# EAGLE schematic gpio-board (EAGLE 9.6.2)

## Sheet 1 of 10
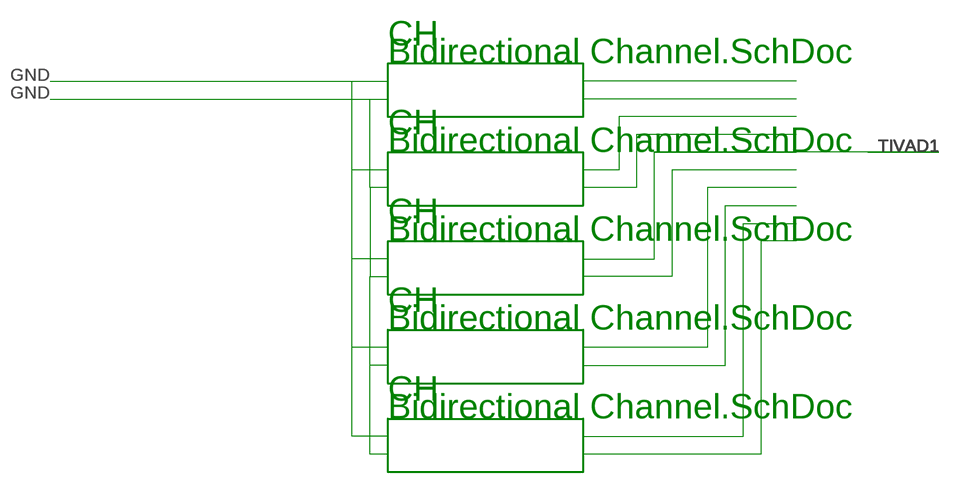
[diagram p0: schematic, sheet 1]

### Notes on the sheet
- CH
- Bidirectional Channel.SchDoc
- CH
- Bidirectional Channel.SchDoc
- CH
- Bidirectional Channel.SchDoc
- CH
- Bidirectional Channel.SchDoc
- CH
- Bidirectional Channel.SchDoc

## Sheet 2 of 10
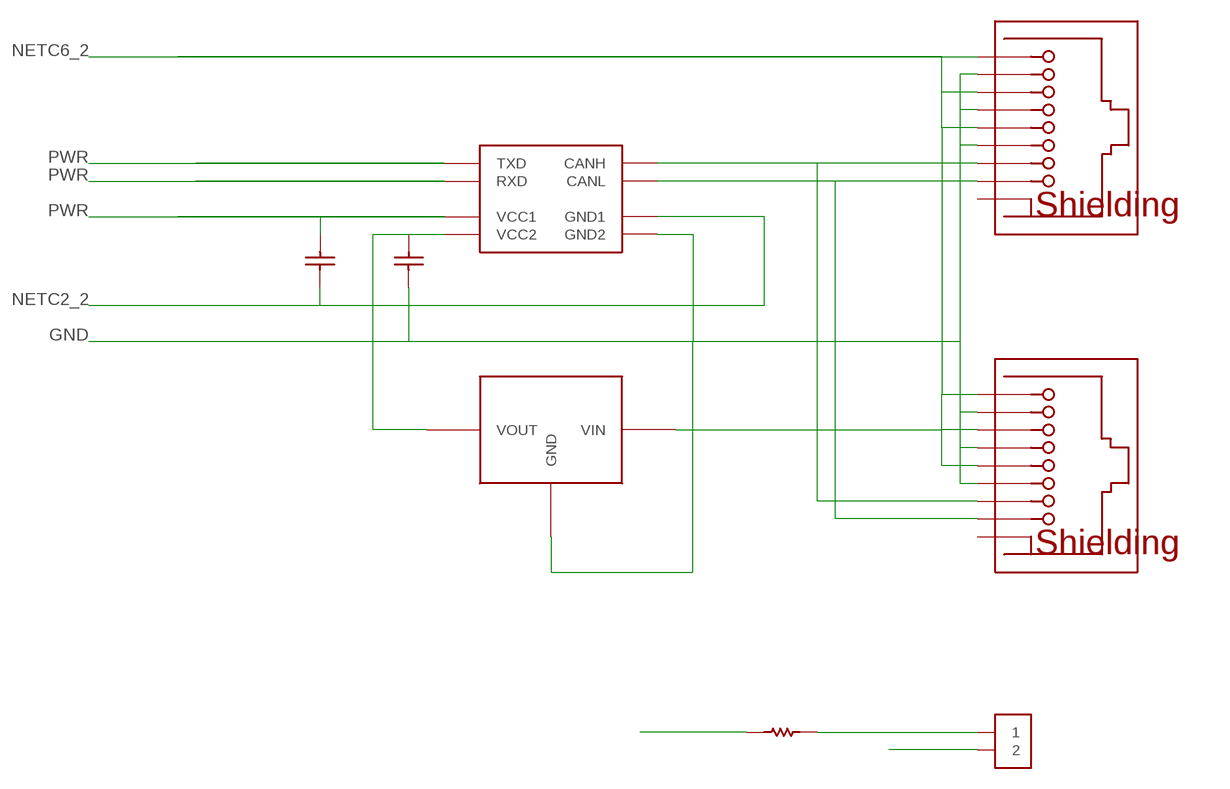
[diagram p1: schematic, sheet 2]

### Parts
C1  CMP-134292-3  (no package)
C2  CMP-134292-3  (no package)
CAN1  SYM-617644-1  (no package)
CAN2  SYM-617644-1  (no package)
R6  CMP-3663850-2  (no package)
TERM  SYM-31C1F8CF33E2EE06-1  (no package)
U1  TI-ISO1050-SOP_DUB-8  (no package)
U2  SYM-21FAE9BB1208FE3D-1  (no package)

### Nets
CANH: CAN1.7 CAN2.7 R6.1 U1.CANH
CANL: CAN1.8 CAN2.8 TERM.2 U1.CANL
GND: C1.2 U1.GND1 ; also sheet 1,3,4,5,6,7,8,9,10
NETC2_1: C2.1 U1.VCC2 U2.VOUT
NETC2_2: C2.2 CAN1.2 CAN1.4 CAN1.6 CAN2.2 CAN2.4 CAN2.6 U1.GND2 U2.GND ; also sheet 3,7
NETC6_2: CAN1.1 CAN1.3 CAN1.5 CAN2.1 CAN2.3 CAN2.5 U2.VIN ; also sheet 3,7
NETR6_2: R6.2 TERM.1
NETU1_2: U1.RXD ; also sheet 6,7
NETU1_3: U1.TXD ; also sheet 6,7
PWR: C1.1 U1.VCC1 ; also sheet 3,4,5,6,7,9,10
Unconnected: C1.1 C1.2 C2.1 C2.2 CAN1.SHIELDING CAN2.SHIELDING R6.1 R6.2

## Sheet 3 of 10
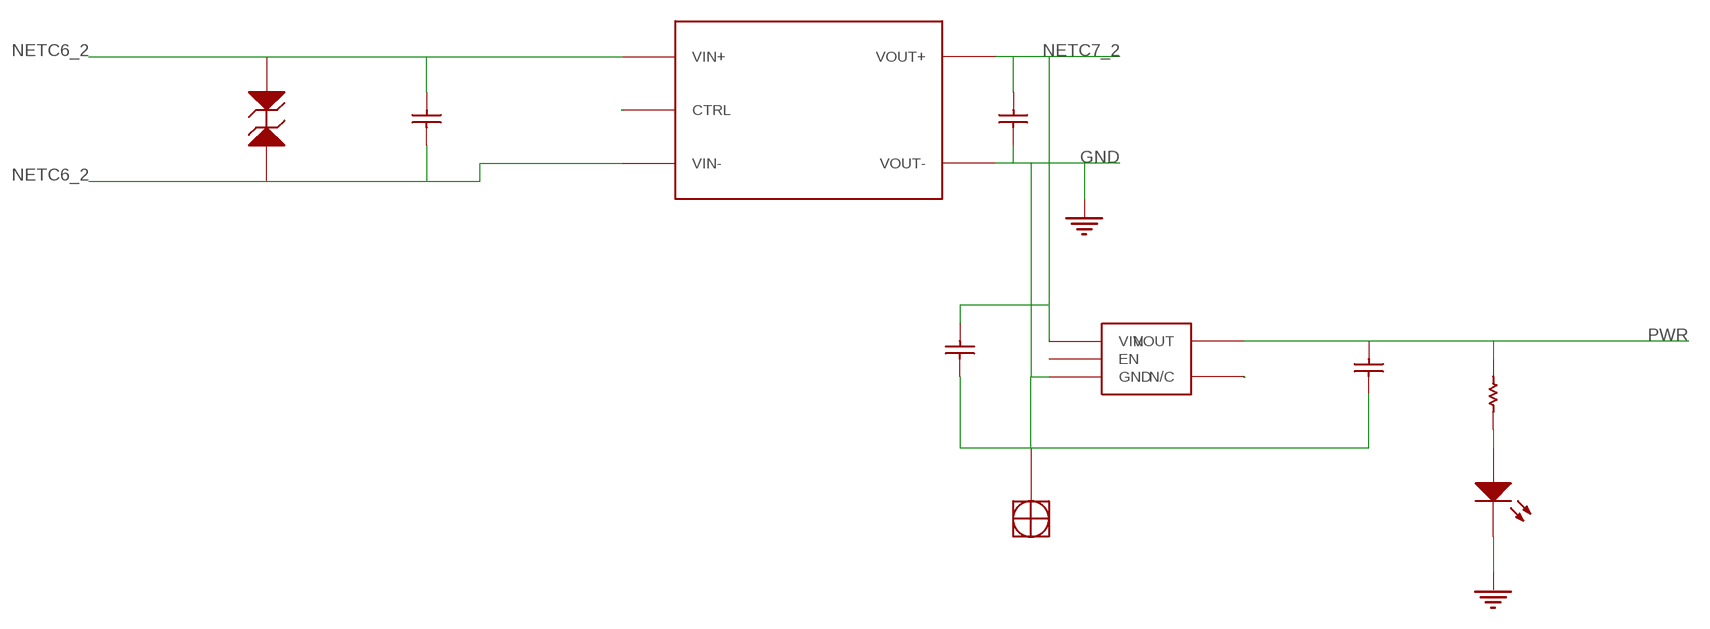
[diagram p2: schematic, sheet 3]

### Parts
C6  SYM-8A2242A3401455E5-1  (no package)
C7  SYM-8A2242A3401455E5-1  (no package)
C12  CMP-134292-3  (no package)
C16  CMP-E20E28C4DC043DC9-1  (no package)
D5  SYM-152EDD67E2CECAE9-1  (no package)
GND1  GND  (no package)
GND2  GND  (no package)
PWR  CMP-46948CFC171D9953-1  (no package)
R7  RES-2  (no package)
TP2  SYM-KVU467Q7N58Y0FITGGB9-1  (no package)
U5  SYM-6Q2ZFNS2C222HNUJAU44-1  (no package)
U6  SYM-7094B98C0241AF53-1  (no package)

### Nets
GND: C7.1 C12.2 C16.1 GND1.GND GND2.GND PWR.2 TP2.1 U5.VOUT- U6.GND ; also sheet 1,2,4,5,6,7,8,9,10
N$1: U5.CTRL
N$8: U6.N/C
NETC2_2: C6.1 D5.A U5.VIN- ; also sheet 2,7
NETC6_2: C6.2 D5.K U5.VIN+ ; also sheet 2,7
NETC7_2: C7.2 C12.1 U5.VOUT+ U6.EN U6.VIN ; also sheet 7,10
NETPWR_1: PWR.1 R7.1
PWR: C16.2 R7.2 U6.VOUT ; also sheet 2,4,5,6,7,9,10
Unconnected: C12.1 C12.2 R7.1 R7.2

## Sheet 4 of 10
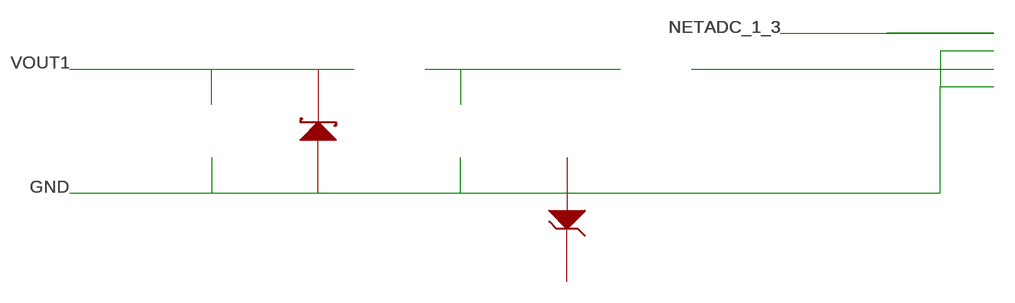
[diagram p3: schematic, sheet 4]

### Parts
D1  SYM-BLEVZ7ZR8NTS6PG0EPLK-1  (no package)
D2  SYM-J4BLMASUWRZVB9CLMQR4-1  (no package)

### Nets
GND: D2.2 ; also sheet 1,2,3,5,6,7,8,9,10
VOUT1: D2.1 ; also sheet 6,7,8
Unconnected: D1.1 D1.3 D1.A D1.K D2.A D2.K

## Sheet 5 of 10
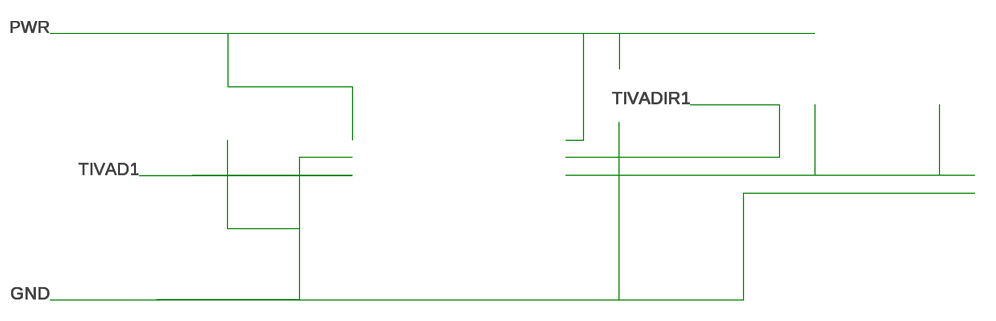
[diagram p4: schematic, sheet 5]

## Sheet 6 of 10
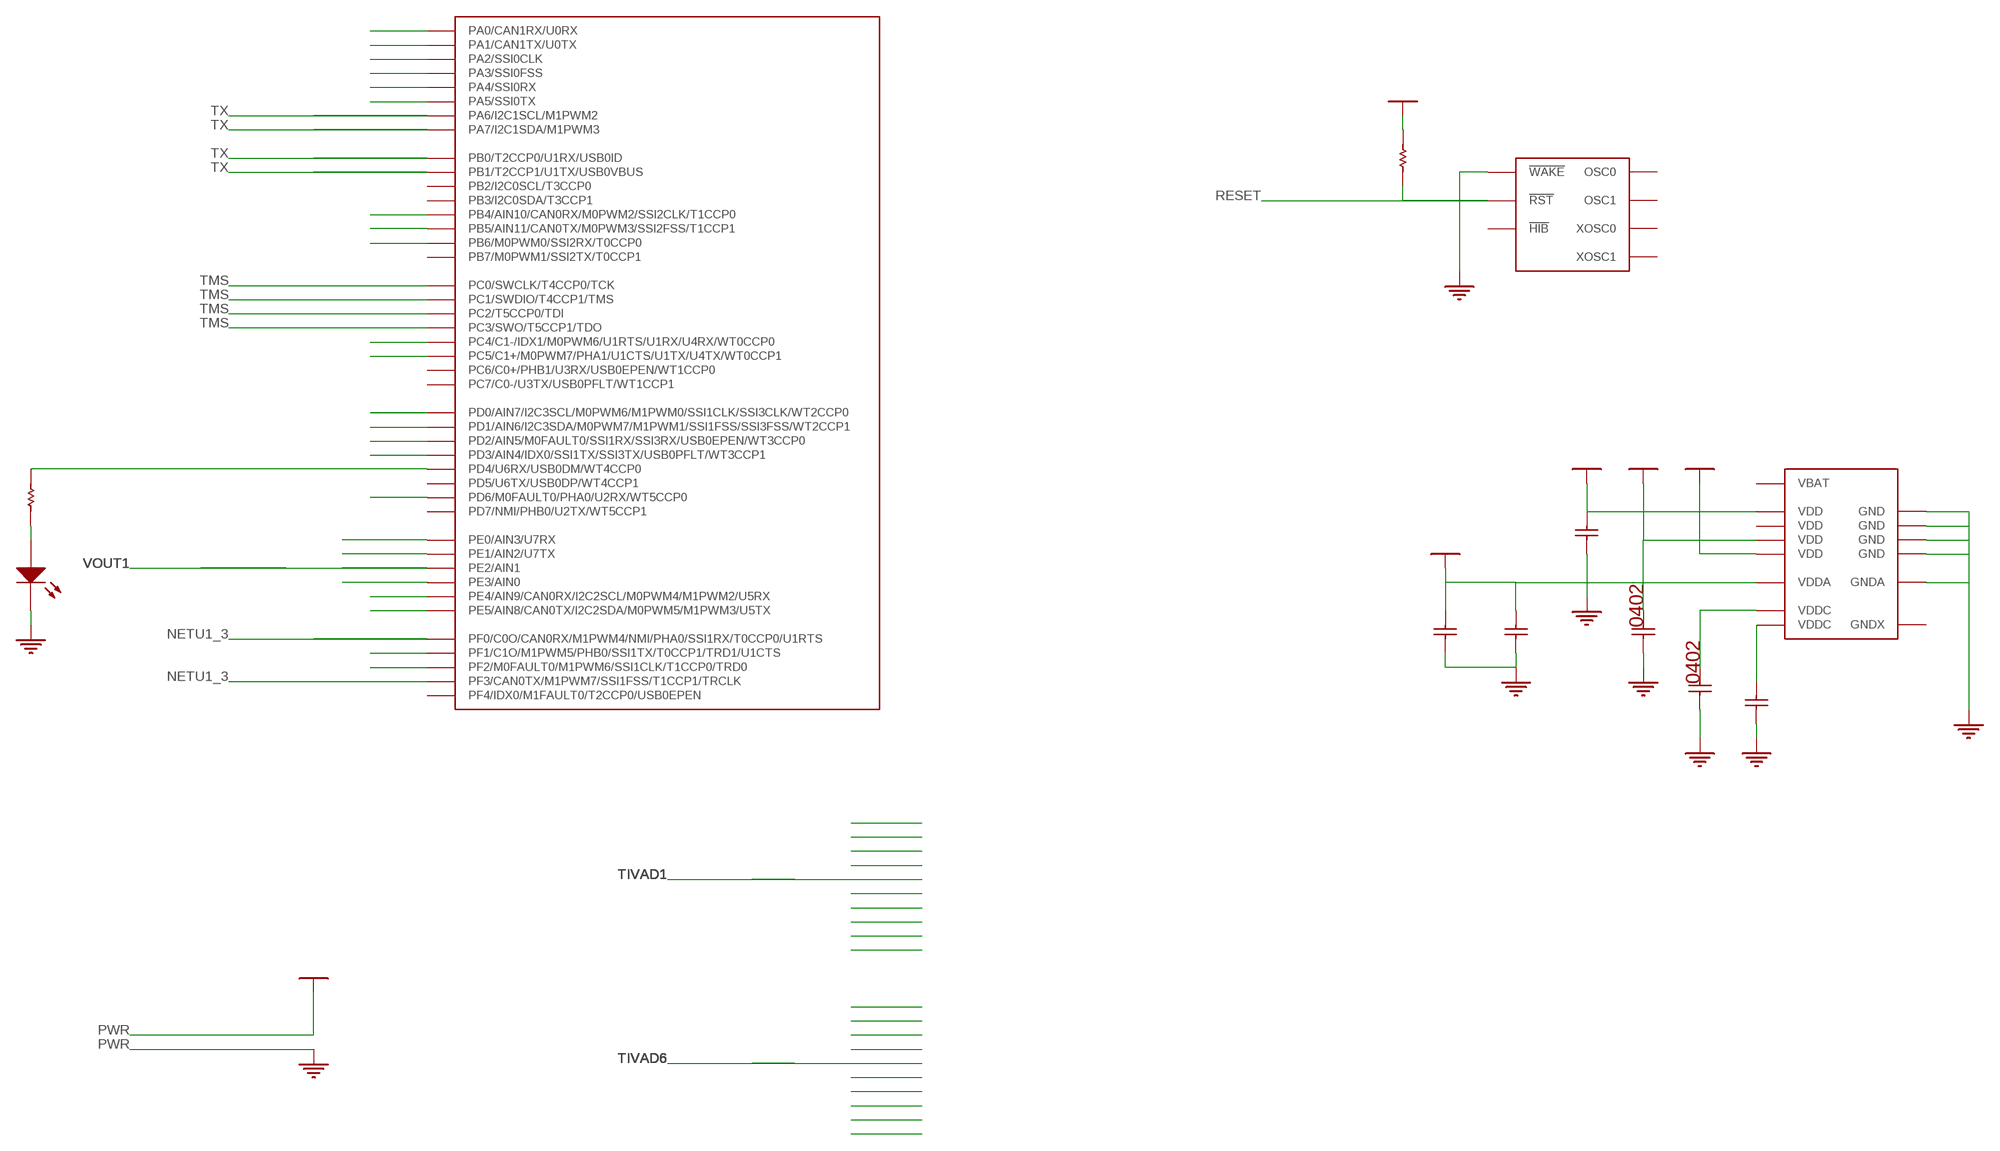
[diagram p5: schematic, sheet 6]

### Parts
C8  CMP-132626-3  (no package)
C9  CMP-119445-3  (no package)
C10  CMP-134292-3  (no package)
C11  CMP-132626-3  (no package)
C13  CMP-E20E28C4DC043DC9-1  (no package)
C15  CMP-3A10F0DA043EE5D7-2  (no package)
DEBUG  CMP-46948CFC171D9953-1  (no package)
GND3  GND  (no package)
GND4  GND  (no package)
GND5  GND  (no package)
GND6  GND  (no package)
GND7  GND  (no package)
GND8  GND  (no package)
GND9  GND  (no package)
GND10  GND  (no package)
GND11  GND  (no package)
PVCC1  VCC  (no package)
PVCC2  VCC  (no package)
PVCC3  VCC  (no package)
PVCC4  VCC  (no package)
PVCC5  VCC  (no package)
PVCC6  VCC  (no package)
R9  CMP-1845928-9  (no package)
R10  RES-2  (no package)
U4  TI-TM4C123GH6PM-LQFP-64  (no package)
U4G2  TI-TM4C123GH6PM-LQFP-64  (no package)
U4G3  TI-TM4C123GH6PM-LQFP-64  (no package)

### Nets
GND: C8.1 C9.1 C10.2 C11.1 C13.1 C15.1 DEBUG.2 GND3.GND GND4.GND GND5.GND GND6.GND GND7.GND GND8.GND GND9.GND GND10.GND GND11.GND U4G2.!WAKE U4G3.GND U4G3.GNDA ; also sheet 1,2,3,4,5,7,8,9,10
NETC11_2: C11.2 U4G3.VDDC
NETC15_2: C15.2 U4G3.VDDC
NETD1_3: U4.PA7/I2C1SDA/M1PWM3 ; also sheet 7,10
NETD3_3: U4.PA6/I2C1SCL/M1PWM2 ; also sheet 7,10
NETDEBUG_1: DEBUG.1 R10.1
NETR10_2: R10.2 U4.PD4/U6RX/USB0DM/WT4CCP0
NETU1_2: U4.PF0/C0O/CAN0RX/M1PWM4/NMI/PHA0/SSI1RX/T0CCP0/U1RTS ; also sheet 2,7
NETU1_3: U4.PF3/CAN0TX/M1PWM7/SSI1FSS/T1CCP1/TRCLK ; also sheet 2,7
PWR: C8.2 C9.2 C10.1 C13.2 PVCC1.PWR PVCC2.PWR PVCC3.PWR PVCC4.PWR PVCC5.PWR PVCC6.PWR R9.2 U4G3.VDD U4G3.VDDA ; also sheet 2,3,4,5,7,9,10
RESET: R9.1 U4G2.!RST ; also sheet 7,9
RX: U4.PB0/T2CCP0/U1RX/USB0ID ; also sheet 7,9
TCK: U4.PC0/SWCLK/T4CCP0/TCK ; also sheet 7,9
TDI: U4.PC2/T5CCP0/TDI ; also sheet 7,9
TDO: U4.PC3/SWO/T5CCP1/TDO ; also sheet 7,9
TIVAD1: U4.PB5/AIN11/CAN0TX/M0PWM3/SSI2FSS/T1CCP1 ; also sheet 1,5,7
TIVAD2: U4.PE4/AIN9/CAN0RX/I2C2SCL/M0PWM4/M1PWM2/U5RX ; also sheet 1
TIVAD3: U4.PD0/AIN7/I2C3SCL/M0PWM6/M1PWM0/SSI1CLK/SSI3CLK/WT2CCP0
TIVAD4: U4.PD2/AIN5/M0FAULT0/SSI1RX/SSI3RX/USB0EPEN/WT3CCP0 ; also sheet 1
TIVAD5: U4.PB6/M0PWM0/SSI2RX/T0CCP0 ; also sheet 1
TIVAD6: U4.PC4/C1-/IDX1/M0PWM6/U1RTS/U1RX/U4RX/WT0CCP0 ; also sheet 7
TIVAD7: U4.PA1/CAN1TX/U0TX
TIVAD8: U4.PA3/SSI0FSS
TIVAD9: U4.PA5/SSI0TX
TIVAD10: U4.PF2/M0FAULT0/M1PWM6/SSI1CLK/T1CCP0/TRD0
TIVADIR1: U4.PD6/M0FAULT0/PHA0/U2RX/WT5CCP0 ; also sheet 1,5
TIVADIR2: U4.PB4/AIN10/CAN0RX/M0PWM2/SSI2CLK/T1CCP0 ; also sheet 1
TIVADIR3: U4.PE5/AIN8/CAN0TX/I2C2SDA/M0PWM5/M1PWM3/U5TX ; also sheet 1
TIVADIR4: U4.PD1/AIN6/I2C3SDA/M0PWM7/M1PWM1/SSI1FSS/SSI3FSS/WT2CCP1 ; also sheet 1
TIVADIR5: U4.PD3/AIN4/IDX0/SSI1TX/SSI3TX/USB0PFLT/WT3CCP1 ; also sheet 1
TIVADIR6: U4.PC5/C1+/M0PWM7/PHA1/U1CTS/U1TX/U4TX/WT0CCP1
TIVADIR7: U4.PA0/CAN1RX/U0RX
TIVADIR8: U4.PA2/SSI0CLK
TIVADIR9: U4.PA4/SSI0RX
TIVADIR10: U4.PF1/C1O/M1PWM5/PHB0/SSI1TX/T0CCP1/TRD1/U1CTS
TMS: U4.PC1/SWDIO/T4CCP1/TMS ; also sheet 7,9
TX: U4.PB1/T2CCP1/U1TX/USB0VBUS ; also sheet 7,9
VOUT1: U4.PE2/AIN1 U4.PE3/AIN0 ; also sheet 4,7,8
VOUT3: U4.PE1/AIN2/U7TX
VOUT4: U4.PE0/AIN3/U7RX ; also sheet 8
Unconnected: C9.1 C9.2 C10.1 C10.2 R10.1 R10.2 U4.!HIB U4.!RST U4.!WAKE U4.GND U4.GNDA U4.GNDX U4.OSC0 U4.OSC1 U4.PB2/I2C0SCL/T3CCP0 U4.PB3/I2C0SDA/T3CCP1 U4.PB7/M0PWM1/SSI2TX/T0CCP1 U4.PC6/C0+/PHB1/U3RX/USB0EPEN/WT1CCP0 U4.PC7/C0-/U3TX/USB0PFLT/WT1CCP1 U4.PD5/U6TX/USB0DP/WT4CCP1 U4.PD7/NMI/PHB0/U2TX/WT5CCP1 U4.PF4/IDX0/M1FAULT0/T2CCP0/USB0EPEN U4.VBAT U4.VDD U4.VDDA U4.VDDC U4.XOSC0 U4.XOSC1 U4G2.!HIB U4G2.GND U4G2.GNDA U4G2.GNDX U4G2.OSC0 U4G2.OSC1 U4G2.PA0/CAN1RX/U0RX U4G2.PA1/CAN1TX/U0TX U4G2.PA2/SSI0CLK U4G2.PA3/SSI0FSS U4G2.PA4/SSI0RX U4G2.PA5/SSI0TX U4G2.PA6/I2C1SCL/M1PWM2 U4G2.PA7/I2C1SDA/M1PWM3 U4G2.PB0/T2CCP0/U1RX/USB0ID U4G2.PB1/T2CCP1/U1TX/USB0VBUS U4G2.PB2/I2C0SCL/T3CCP0 U4G2.PB3/I2C0SDA/T3CCP1 U4G2.PB4/AIN10/CAN0RX/M0PWM2/SSI2CLK/T1CCP0 U4G2.PB5/AIN11/CAN0TX/M0PWM3/SSI2FSS/T1CCP1 U4G2.PB6/M0PWM0/SSI2RX/T0CCP0 U4G2.PB7/M0PWM1/SSI2TX/T0CCP1 U4G2.PC0/SWCLK/T4CCP0/TCK U4G2.PC1/SWDIO/T4CCP1/TMS U4G2.PC2/T5CCP0/TDI U4G2.PC3/SWO/T5CCP1/TDO U4G2.PC4/C1-/IDX1/M0PWM6/U1RTS/U1RX/U4RX/WT0CCP0 U4G2.PC5/C1+/M0PWM7/PHA1/U1CTS/U1TX/U4TX/WT0CCP1 U4G2.PC6/C0+/PHB1/U3RX/USB0EPEN/WT1CCP0 U4G2.PC7/C0-/U3TX/USB0PFLT/WT1CCP1 U4G2.PD0/AIN7/I2C3SCL/M0PWM6/M1PWM0/SSI1CLK/SSI3CLK/WT2CCP0 U4G2.PD1/AIN6/I2C3SDA/M0PWM7/M1PWM1/SSI1FSS/SSI3FSS/WT2CCP1 U4G2.PD2/AIN5/M0FAULT0/SSI1RX/SSI3RX/USB0EPEN/WT3CCP0 U4G2.PD3/AIN4/IDX0/SSI1TX/SSI3TX/USB0PFLT/WT3CCP1 U4G2.PD4/U6RX/USB0DM/WT4CCP0 U4G2.PD5/U6TX/USB0DP/WT4CCP1 U4G2.PD6/M0FAULT0/PHA0/U2RX/WT5CCP0 U4G2.PD7/NMI/PHB0/U2TX/WT5CCP1 U4G2.PE0/AIN3/U7RX U4G2.PE1/AIN2/U7TX U4G2.PE2/AIN1 U4G2.PE3/AIN0 U4G2.PE4/AIN9/CAN0RX/I2C2SCL/M0PWM4/M1PWM2/U5RX U4G2.PE5/AIN8/CAN0TX/I2C2SDA/M0PWM5/M1PWM3/U5TX U4G2.PF0/C0O/CAN0RX/M1PWM4/NMI/PHA0/SSI1RX/T0CCP0/U1RTS U4G2.PF1/C1O/M1PWM5/PHB0/SSI1TX/T0CCP1/TRD1/U1CTS U4G2.PF2/M0FAULT0/M1PWM6/SSI1CLK/T1CCP0/TRD0 U4G2.PF3/CAN0TX/M1PWM7/SSI1FSS/T1CCP1/TRCLK U4G2.PF4/IDX0/M1FAULT0/T2CCP0/USB0EPEN U4G2.VBAT U4G2.VDD U4G2.VDDA U4G2.VDDC U4G2.XOSC0 U4G2.XOSC1 U4G3.!HIB U4G3.!RST U4G3.!WAKE U4G3.GNDX U4G3.OSC0 U4G3.OSC1 U4G3.PA0/CAN1RX/U0RX U4G3.PA1/CAN1TX/U0TX U4G3.PA2/SSI0CLK U4G3.PA3/SSI0FSS U4G3.PA4/SSI0RX U4G3.PA5/SSI0TX U4G3.PA6/I2C1SCL/M1PWM2 U4G3.PA7/I2C1SDA/M1PWM3 U4G3.PB0/T2CCP0/U1RX/USB0ID U4G3.PB1/T2CCP1/U1TX/USB0VBUS U4G3.PB2/I2C0SCL/T3CCP0 U4G3.PB3/I2C0SDA/T3CCP1 U4G3.PB4/AIN10/CAN0RX/M0PWM2/SSI2CLK/T1CCP0 U4G3.PB5/AIN11/CAN0TX/M0PWM3/SSI2FSS/T1CCP1 U4G3.PB6/M0PWM0/SSI2RX/T0CCP0 U4G3.PB7/M0PWM1/SSI2TX/T0CCP1 U4G3.PC0/SWCLK/T4CCP0/TCK U4G3.PC1/SWDIO/T4CCP1/TMS U4G3.PC2/T5CCP0/TDI U4G3.PC3/SWO/T5CCP1/TDO U4G3.PC4/C1-/IDX1/M0PWM6/U1RTS/U1RX/U4RX/WT0CCP0 U4G3.PC5/C1+/M0PWM7/PHA1/U1CTS/U1TX/U4TX/WT0CCP1 U4G3.PC6/C0+/PHB1/U3RX/USB0EPEN/WT1CCP0 U4G3.PC7/C0-/U3TX/USB0PFLT/WT1CCP1 U4G3.PD0/AIN7/I2C3SCL/M0PWM6/M1PWM0/SSI1CLK/SSI3CLK/WT2CCP0 U4G3.PD1/AIN6/I2C3SDA/M0PWM7/M1PWM1/SSI1FSS/SSI3FSS/WT2CCP1 U4G3.PD2/AIN5/M0FAULT0/SSI1RX/SSI3RX/USB0EPEN/WT3CCP0 U4G3.PD3/AIN4/IDX0/SSI1TX/SSI3TX/USB0PFLT/WT3CCP1 U4G3.PD4/U6RX/USB0DM/WT4CCP0 U4G3.PD5/U6TX/USB0DP/WT4CCP1 U4G3.PD6/M0FAULT0/PHA0/U2RX/WT5CCP0 U4G3.PD7/NMI/PHB0/U2TX/WT5CCP1 U4G3.PE0/AIN3/U7RX U4G3.PE1/AIN2/U7TX U4G3.PE2/AIN1 U4G3.PE3/AIN0 U4G3.PE4/AIN9/CAN0RX/I2C2SCL/M0PWM4/M1PWM2/U5RX U4G3.PE5/AIN8/CAN0TX/I2C2SDA/M0PWM5/M1PWM3/U5TX U4G3.PF0/C0O/CAN0RX/M1PWM4/NMI/PHA0/SSI1RX/T0CCP0/U1RTS U4G3.PF1/C1O/M1PWM5/PHB0/SSI1TX/T0CCP1/TRD1/U1CTS U4G3.PF2/M0FAULT0/M1PWM6/SSI1CLK/T1CCP0/TRD0 U4G3.PF3/CAN0TX/M1PWM7/SSI1FSS/T1CCP1/TRCLK U4G3.PF4/IDX0/M1FAULT0/T2CCP0/USB0EPEN U4G3.VBAT U4G3.VDD U4G3.XOSC0 U4G3.XOSC1

## Sheet 7 of 10
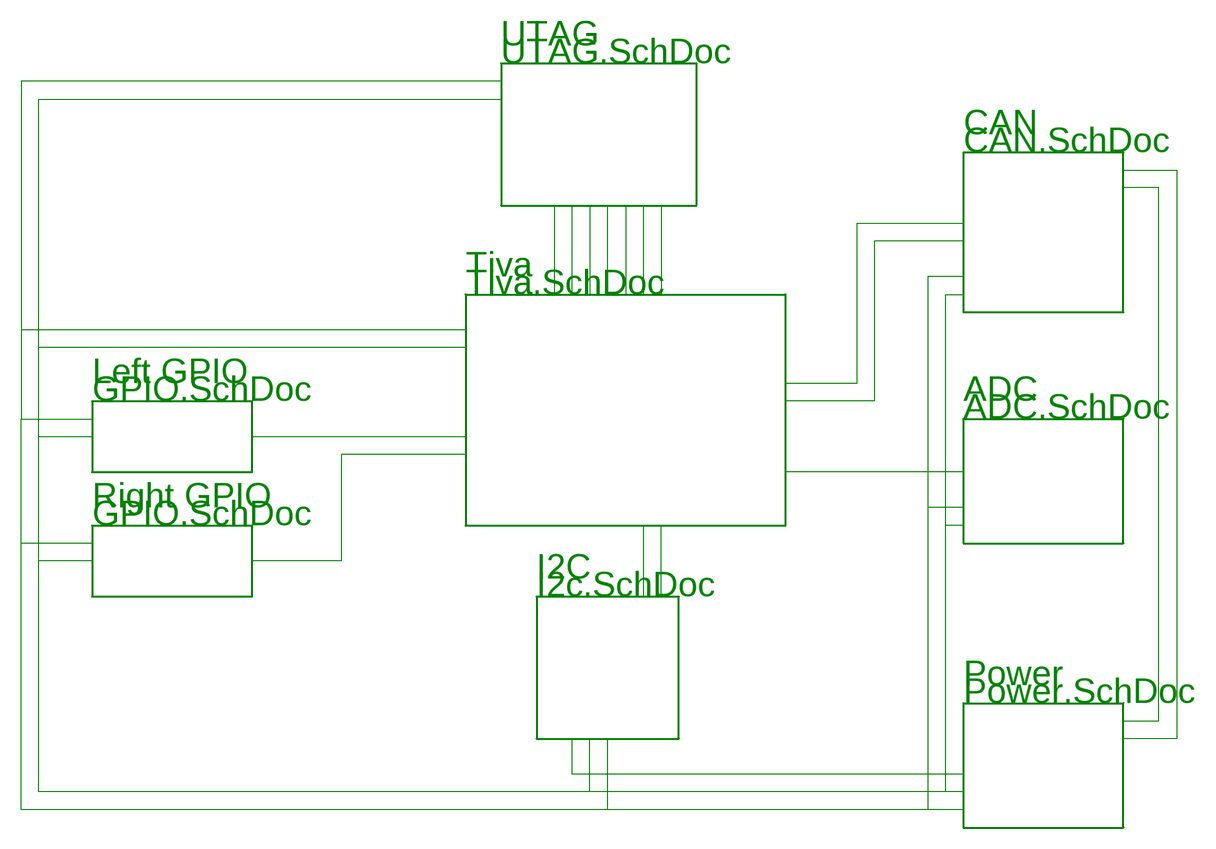
[diagram p6: schematic, sheet 7]

### Notes on the sheet
- UTAG
- UTAG.SchDoc
- CAN
- CAN.SchDoc
- Tiva
- Tiva.SchDoc
- Left GPIO
- GPIO.SchDoc | ADC
- ADC.SchDoc
- Right GPIO
- GPIO.SchDoc
- I2C
- I2c.SchDoc
- Power
- Power.SchDoc

## Sheet 8 of 10
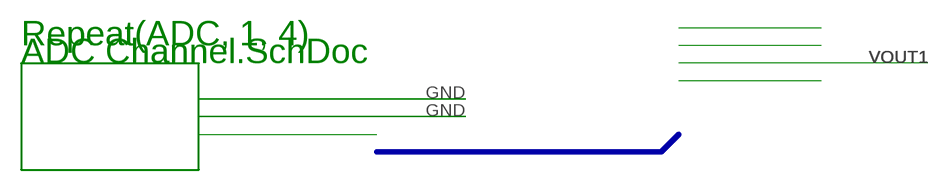
[diagram p7: schematic, sheet 8]

### Buses
BUS0000

### Notes on the sheet
- Repeat(ADC, 1, 4)
- ADC Channel.SchDoc

## Sheet 9 of 10
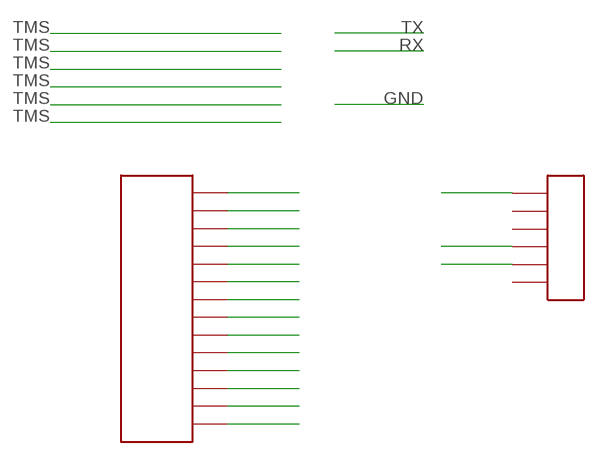
[diagram p8: schematic, sheet 9]

### Parts
PROG  CMP-94475D216EAA4B80-7  (no package)
UART  CMP-3923147-6  (no package)

### Nets
GND: PROG.4 PROG.6 PROG.8 PROG.10 PROG.12 UART.1 ; also sheet 1,2,3,4,5,6,7,8,10
N$17: PROG.9
NETPROG_13: PROG.13
NETPROG_14: PROG.14
PWR: PROG.5 ; also sheet 2,3,4,5,6,7,10
RESET: PROG.2 ; also sheet 6,7
RX: UART.4 ; also sheet 6,7
TCK: PROG.11 ; also sheet 6,7
TDI: PROG.3 ; also sheet 6,7
TDO: PROG.7 ; also sheet 6,7
TMS: PROG.1 ; also sheet 6,7
TX: UART.5 ; also sheet 6,7
Unconnected: UART.2 UART.3 UART.6

## Sheet 10 of 10
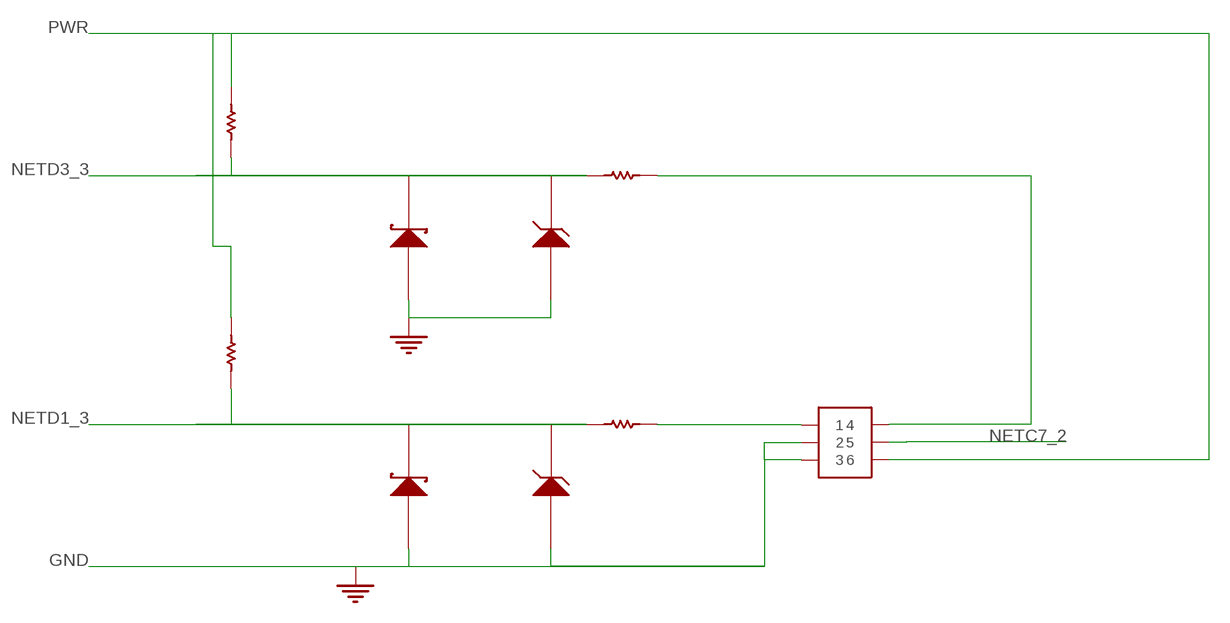
[diagram p9: schematic, sheet 10]

### Parts
D3  SYM-BLEVZ7ZR8NTS6PG0EPLK-1  (no package)
D4  SYM-J4BLMASUWRZVB9CLMQR4-1  (no package)
GND12  GND  (no package)
GND13  GND  (no package)
I2C  SYM-16A2DF8BBED4C965-2  (no package)
R4  CMP-3654904-3  (no package)
R5  CMP-3654904-3  (no package)
R8  CMP-1845928-9  (no package)
U3  SYM-BLEVZ7ZR8NTS6PG0EPLK-1  (no package)
U7  SYM-J4BLMASUWRZVB9CLMQR4-1  (no package)
U8  CMP-1845928-9  (no package)

### Nets
GND: D3.1 D4.2 GND12.GND GND13.GND U3.1 U7.2 ; also sheet 1,2,3,4,5,6,7,8,9
NETD1_3: R5.1 U3.3 U7.1 U8.1 ; also sheet 6,7
NETD3_3: D3.3 D4.1 R4.1 R8.1 ; also sheet 6,7
NETI2C_1: R5.2
NETI2C_4: R4.2
PWR: I2C.6 R8.2 U8.2 ; also sheet 2,3,4,5,6,7,9
Unconnected: D3.A D3.K D4.A D4.K I2C.1 I2C.2 I2C.3 I2C.4 I2C.5 U3.A U3.K U7.A U7.K

## Library data of the parts
C1 C2 C10 C12 = Main:CMP-134292-3; CAPACITANCE: 1e-07_F; CAPACITANCE_TOLERA32: ±10%; COMMENT: 0.1uF; DIELECTRIC_CHARACT73: X7R; MANUFACTURER_PART_D3: GCM188R71E104KA57D; OCTOPARTID: 7b60b365ff62a4a7; OCTOPART_URL: https://octopart.com/gcm188r71e104ka57d-murata-17801572; ROHS: Compliant; VOLTAGE_RATING__DC_: 25.0_V
C6 C7 = Main:SYM-8A2242A3401455E5-1; CAPACITANCE: 10.0_µF; CAPACITANCE_TOLERA32: ±10%; CASE_PACKAGE: 1206,_3216; COMMENT: TDK_CGA5L1X7R1E106K160AC; DIELECTRIC_CHARACT73: X7R; LEAD-FREE_STATUS: Lead_Free; MANUFACTURER_PART_D3: CGA5L1X7R1E106K160AC; OCTOPARTID: 8a2242a3401455e5; OCTOPART_URL: http://octopart.com/cga5l1x7r1e106k160ac-tdk-25947984; PACKAGING: Cut_Tape__CT_; REACH_SVHC_COMPLIA3F: No_SVHC; ROHS: Compliant; VOLTAGE_RATING__DC_: 25.0_V
C8 C11 = Main:CMP-132626-3; CAPACITANCE: 0.1uF; CAPACITANCE_TOLERA32: ±10%; COMMENT: Murata_GCM155R71C104KA55D; OPERATING_TEMPERAT27: -55.0_°C__min_
C9 = Main:CMP-119445-3; CAPACITANCE: .01uF; CAPACITANCE_TOLERA32: ±10%; COMMENT: Murata_GCM188R72A103KA37D; DIELECTRIC_CHARACT73: X7R; LEAD-FREE_STATUS: Lead_Free; MANUFACTURER_PART_D3: GCM188R72A103KA37D; OCTOPARTID: da45133788310582; OCTOPART_URL: https://octopart.com/gcm188r72a103ka37d-murata-7894802; REACH_SVHC_COMPLIA3F: No_SVHC; ROHS: Compliant; VOLTAGE_RATING__DC_: 100.0_V
C13 C16 = Main:CMP-E20E28C4DC043DC9-1; CAPACITANCE: 2.2u; COMMENT: Murata_GRT188C8YA225KE13D; DIGIKEY_PART_NUMBER: 490-12299-1-ND; HOMEPAGE_URL: https://www.digikey.com/product-detail/en/murata-electronics-north-america/GRT188C8YA225KE13D/490-12299-1-ND/5417000; LEAD-FREE_STATUS: Lead_Free; MANUFACTURER_PART_D3: GRT188C8YA225KE13D; OCTOPARTID: e20e28c4dc043dc9
C15 = Main:CMP-3A10F0DA043EE5D7-2; CAPACITANCE: 1_uF; COMMENT: Cap
CAN1 CAN2 = Main:SYM-617644-1; COMMENT: Assmann_A-2004-2-4-LPS-N-R; CONNECTOR_TYPE: Jack; CONTACT_FINISH: Gold; CONTACT_FINISH_THI6D: 6µin__0.152µm_; CONTACT_MATERIAL: Bronze_Gold_Plating_over_Nickel; CONTACT_RESISTANCE: 20_MO_Max.; DURABILITY: 500_Mating_cycles_Min.; FEATURES: Board_Lock; HEIGHT: 13.30_mm; HOUSING_MATERIAL: Polybutylene_Terephthalate__PBT_,_Glass_Filled; INSULATION_RESISTA91: 500_MO_Min.; LEAD-FREE_STATUS: Lead_Free; MANUFACTURER_PART_D3: A-2004-2-4-LPS-N-R; MOUNTING_TYPE: Through_Hole; NUMBER_OF_PORTS: 1; NUMBER_OF_POSITION63: 8p8c__RJ45,_Ethernet_; OCTOPARTID: fadd32f5407a251a; OCTOPART_URL: https://octopart.com/a-2004-2-4-lps-n-r-assmann+electronics-19046337; OPERATING_TEMPERAT27: -40°C_~_85°C; ORIENTATION: 90°_Angle__Right_; RATING_CURRENT: 1.5_A_Max.; RATING_VOLTAGE: 120_V_AC; ROHS: Compliant; SHIELDING: Shielded; SOLDERING_TEMPERAT11: 235_°C; TERMINATION: Solder
D1 D3 = Main:SYM-BLEVZ7ZR8NTS6PG0EPLK-1; COMMENT: BZX84B5V1LT1G; CUSTOMCOMPONENTID: blevz7zr8nts6pg0eplk
D2 D4 = Main:SYM-J4BLMASUWRZVB9CLMQR4-1; COMMENT: CUS520,H3F
D5 = Main:SYM-152EDD67E2CECAE9-1; COMMENT: ESD12VD3B-TP; LEAD-FREE_STATUS: Lead_Free; MANUFACTURER_PART_D3: ESD12VD3B-TP; OCTOPARTID: 152edd67e2cecae9; PACKAGING: Reel; ROHS: Compliant
DEBUG PWR = Main:CMP-46948CFC171D9953-1; COMMENT: LED; LEAD-FREE_STATUS: Lead_Free; MANUFACTURER_PART_D3: APT1608LZGCK; OCTOPARTID: 46948cfc171d9953; OCTOPART_URL: https://octopart.com/apt1608lzgck-kingbright-56784111
GND1-GND13 = Main:GND
I2C = Main:SYM-16A2DF8BBED4C965-2; COLOR: Black; COMMENT: Molex_43045-0613; CONTACT_MATERIAL: Brass; CONTACT_PLATING: Gold; CURRENT_RATING: 5.00_A; GENDER: Male; GLOW_WIRE_COMPLIANT: Compliant; HALOGEN_FREE_STATUS: Low_Halogen; LIFECYCLE_STATUS: Active; MANUFACTURER_PART_D3: 43045-0613; MATED_HEIGHT: 17.3_mm; MOUNTING_STYLE: Through_Hole,_Vertical; NUMBER_OF_CIRCUITS: 6; NUMBER_OF_CONTACTS: 6; NUMBER_OF_ROWS: 2; OCTOPARTID: 16a2df8bbed4c965; OCTOPART_URL: http://octopart.com/43045-0613-molex-2329872; ORIENTATION: Vertical; ROHS: Compliant
PROG = Main:CMP-94475D216EAA4B80-7; COMMENT: JTAG; NUMBER_OF_ROWS: 2; PACKAGING: Bag
PVCC1-PVCC6 = Main:VCC
R4 R5 = Main:CMP-3654904-3; COMMENT: Panasonic_ERJ-3GEYJ472V; COMPOSITION: Thick_Film; HEIGHT: 0.022/"__0.55mm_; MANUFACTURER: Panasonic_Electronic_Components; MANUFACTURER_PART_D3: ERJ-3GEYJ472V; OCTOPARTID: 5b8091c7d2788447; OCTOPART_URL: http://octopart.com/erj-3geyj472v-panasonic-55422110; PACKAGE___CASE: 0603; POWER__WATTS_: 0.1W; RESISTANCE__OHMS_: 4.7k; TOLERANCE: ±5%; VENDOR: Digikey; VENDOR_PART_NUMBER: P4.7KGCT-ND
R6 = Main:CMP-3663850-2; CASE_PACKAGE: 1206; CASE_PACKAGE__SI_: 3216; COMMENT: Panasonic_ERJ-8GEYJ121V; LEAD-FREE_STATUS: Lead_Free; LIFECYCLE_STATUS: Not_Listed_by_Manufacturer; MANUFACTURER_PART_D3: ERJ-8GEYJ121V; MOUNTING_STYLE: Surface_Mount; OCTOPARTID: 773cbd7be10da8fb; OCTOPART_URL: https://octopart.com/erj-8geyj121v-panasonic-55423831; PACKAGING: Cut_Tape__CT_; POWER_RATING: 0.25_W; REACH_SVHC_COMPLIA3F: No_SVHC; RESISTANCE: 120.0_O; RESISTANCE_TOLERANCE: ±5%; ROHS: Compliant; SIZE-HEIGHT: 0.0006_m; SIZE-LENGTH: 0.0032_m; SIZE-WIDTH: 0.0016_m; VOLTAGE_RATING__DC_: 200.0_V
R7 R10 = Main:RES-2; CASE_PACKAGE: 0603; COMMENT: Panasonic_ERJ-3GEYJ331V; LEAD-FREE_STATUS: Lead_Free; LIFECYCLE_STATUS: Not_Listed_by_Manufacturer; MANUFACTURER_PART_D3: ERJ-3GEYJ331V; MOUNTING_STYLE: Surface_Mount; OCTOPARTID: 84d24e950dcb5b15; OCTOPART_URL: https://octopart.com/erj-3geyj331v-panasonic-55422079; PACKAGING: Cut_Tape__CT_; POWER_RATING: 0.1_W; REACH_SVHC_COMPLIA3F: No_SVHC; RESISTANCE: 330.0_O; RESISTANCE_TOLERANCE: ±5%; ROHS: Compliant; SIZE-HEIGHT: 0.00045_m; SIZE-LENGTH: 0.0016_m; SIZE-WIDTH: 0.0008_m; VOLTAGE_RATING__DC_: 75.0_V
R8 R9 = Main:CMP-1845928-9; CASE_PACKAGE__SI_: 1608; COMMENT: Res1; LEAD-FREE_STATUS: Lead_Free; MOUNTING_STYLE: Surface_Mount; OCTOPART_URL: https://octopart.com/erj-3geyj103v-panasonic-55403671; OPERATING_TEMPERAT27: 125_°C__max_; RESISTANCE: 10k; SIZE-WIDTH: 800_µm; TOLERANCE: ±5%; VOLTAGE_RATING__DC_: 75.0_V
TERM = Main:SYM-31C1F8CF33E2EE06-1; COMMENT: Samtec_TSW-102-07-G-S
TP2 = Main:SYM-KVU467Q7N58Y0FITGGB9-1; COMMENT: Test_Pad; CUSTOMCOMPONENTID: kvu467q7n58y0fitggb9
U1 = Main:TI-ISO1050-SOP_DUB-8; CASE_PACKAGE: SOP; COMMENT: TI-ISO1050-SOP_DUB-8; DRIVERS_PER_PACKAGE: 1; LEAD-FREE_STATUS: Lead_Free; LIFECYCLE_STATUS: Active; MANUFACTURER_PART_D3: ISO1050DUBR; MOUNTING_STYLE: Surface_Mount; OCTOPART_URL: https://octopart.com/iso1050dubr-texas+instruments-10682911; OUTPUT_VOLTAGE: 5.0_V; PACKAGING: Cut_Tape__CT_; REACH_SVHC_COMPLIA3F: No_SVHC; THERMAL_SHUTDOWN: Yes
U2 = Main:SYM-21FAE9BB1208FE3D-1; COMMENT: Recom_Power_R-78E5.0-0.5
U3 = Main:SYM-BLEVZ7ZR8NTS6PG0EPLK-1
U4 U4G2 U4G3 = Main:TI-TM4C123GH6PM-LQFP-64; COMMENT: TM4C123GH6PMIR; FLASH_MEMORY_SIZE: 262144_B; LEAD-FREE_STATUS: Lead_Free; LIFECYCLE_STATUS: Active; MANUFACTURER_PART_D3: TM4C123GH6PMIR; NUMBER_OF_ADCS: 12; NUMBER_OF_BITS: 12; NUMBER_OF_PINS: 64; NUMBER_OF_UARTS: 8; OCTOPARTID: 1568ddd08d62caaf; OCTOPART_URL: https://octopart.com/tm4c123gh6pmir-texas+instruments-28491116; ROHS: Compliant
U5 = Main:SYM-6Q2ZFNS2C222HNUJAU44-1; COMMENT: NCS1S2405SC; CUSTOMCOMPONENTID: 6q2zfns2c222hnujau44; DIGIKEY_PART_NUMBER: 811-2948-ND; MANUFACTURER: Murata
U6 = Main:SYM-7094B98C0241AF53-1; CASE_PACKAGE: TSOT-23-5,_SOT-23-5; COMMENT: ON_Semiconductor_NCV551SN33T1G; DIGIKEY_PART_NUMBER: NCV551SN33T1GOSCT-ND; HOMEPAGE_URL: https://www.digikey.com/product-detail/en/on-semiconductor/NCV551SN33T1G/NCV551SN33T1GOSCT-ND/2121771; LEAD-FREE_STATUS: Lead_Free; LIFECYCLE_STATUS: Active; MANUFACTURER_PART_D3: NCV551SN33T1G; MOUNTING_STYLE: Surface_Mount; NUMBER_OF_PINS: 5; OCTOPARTID: 7094b98c0241af53; OCTOPART_URL: https://octopart.com/ncv551sn33t1g-on+semiconductor-1202099; OPERATING_TEMPERAT27: -40.0_°C__min_; OUTPUT_CURRENT: 150_mA; PACKAGING: Tape_&_Reel__TR_; REACH_SVHC_COMPLIA3F: No_SVHC; ROHS: Compliant
U7 = Main:SYM-J4BLMASUWRZVB9CLMQR4-1
U8 = Main:CMP-1845928-9
UART = Main:CMP-3923147-6; COMMENT: SYM-eb5f2251e9703498-3; CONTACT_PLATING: Gold; HOUSING_COLOR: Black; MANUFACTURER_PART_D3: TSW-106-07-G-S; NUMBER_OF_POSITIONS: 6; PIN_PITCH: 2.54_mm